# Altium schematic sheet SecondaryMCU.SchDoc
size A4
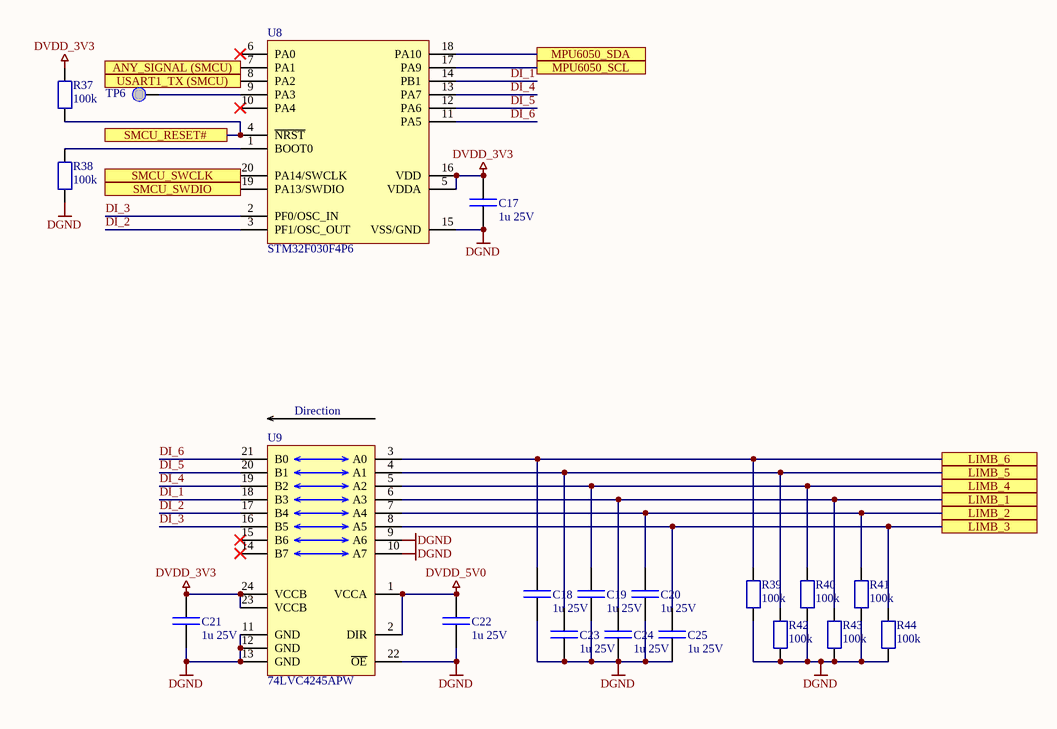
[diagram p0: SecondaryMCU.SchDoc]

## Parts
C17  1u 25V  [C_0603/1608]
C18  1u 25V  [C_0805/2012]
C19  1u 25V  [C_0805/2012]
C20  1u 25V  [C_0805/2012]
C21  1u 25V  [C_0603/1608]
C22  1u 25V  [C_0603/1608]
C23  1u 25V  [C_0805/2012]
C24  1u 25V  [C_0805/2012]
C25  1u 25V  [C_0805/2012]
R37  100k  [R_0603/1608]
R38  100k  [R_0603/1608]
R39  100k  [R_0402/1005]
R40  100k  [R_0402/1005]
R41  100k  [R_0402/1005]
R42  100k  [R_0402/1005]
R43  100k  [R_0402/1005]
R44  100k  [R_0402/1005]
TP6  Debug  [TP_SMD_D1.00]  (value not drawn)  (no BOM)
U8  STM32F030F4P6  [SO20_0.65]
U9  74LVC4245APW  [SO24_0.65]

## Ports
ANY_SIGNAL (SMCU), LIMB_1, LIMB_2, LIMB_3, LIMB_4, LIMB_5, LIMB_6, MPU6050_SCL, MPU6050_SDA, SMCU_RESET#, SMCU_SWCLK, SMCU_SWDIO, USART1_TX (SMCU)

## Nets
DGND: C17.2 C18.2 C19.2 C20.2 C21.2 C22.2 C23.2 C24.2 C25.2 R38.2 R39.2 R40.2 R41.2 R42.2 R43.2 R44.2 U8.15(VSS/GND) U9.9(A6) U9.10(A7) U9.11(GND) U9.12(GND) U9.13(GND) U9.22(~{OE})
DVDD_3V3: C17.1 C21.1 R37.1 U8.5(VDDA) U8.16(VDD) U9.23(VCCB) U9.24(VCCB)
DVDD_5V0: C22.1 U9.1(VCCA) U9.2(DIR)
ANY_SIGNAL (SMCU): U8.7(PA1) ; port ANY_SIGNAL (SMCU)
DI_1: U8.14(PB1) U9.18(B3)
DI_2: U8.3(PF1/OSC_OUT) U9.17(B4)
DI_3: U8.2(PF0/OSC_IN) U9.16(B5)
DI_4: U8.13(PA7) U9.19(B2)
DI_5: U8.12(PA6) U9.20(B1)
DI_6: U8.11(PA5) U9.21(B0)
LIMB_1: C24.1 R43.1 U9.6(A3) ; port LIMB_1
LIMB_2: C20.1 R41.1 U9.7(A4) ; port LIMB_2
LIMB_3: C25.1 R44.1 U9.8(A5) ; port LIMB_3
LIMB_4: C19.1 R40.1 U9.5(A2) ; port LIMB_4
LIMB_5: C23.1 R42.1 U9.4(A1) ; port LIMB_5
LIMB_6: C18.1 R39.1 U9.3(A0) ; port LIMB_6
MPU6050_SCL: U8.17(PA9) ; port MPU6050_SCL
MPU6050_SDA: U8.18(PA10) ; port MPU6050_SDA
SMCU_RESET#: R37.2 U8.4(~{NRST}) ; port SMCU_RESET#
SMCU_SWCLK: U8.20(PA14/SWCLK) ; port SMCU_SWCLK
SMCU_SWDIO: U8.19(PA13/SWDIO) ; port SMCU_SWDIO
USART1_TX (SMCU): U8.8(PA2) ; port USART1_TX (SMCU)
NetR38_1: R38.1 U8.1(BOOT0)
NetTP6_1: TP6.1 U8.9(PA3)

Not connected (* = marked no-connect by the designer): U8 0(EP) 6(PA0)* 10(PA4)*; U9 14(B7)* 15(B6)*

## Notes on the sheet
- (near U9) Direction

## Library data of the parts
C17-C25 = Capacitor: Non-polarized capacitor
R37-R44 = Resistor
TP6 = Test point
U8 = STM32F030F: 32-bit Cortex-M0
U9 = 74LVC4245APW: Logic level converter